# EAGLE design Power Board (EAGLE 7.6.0)
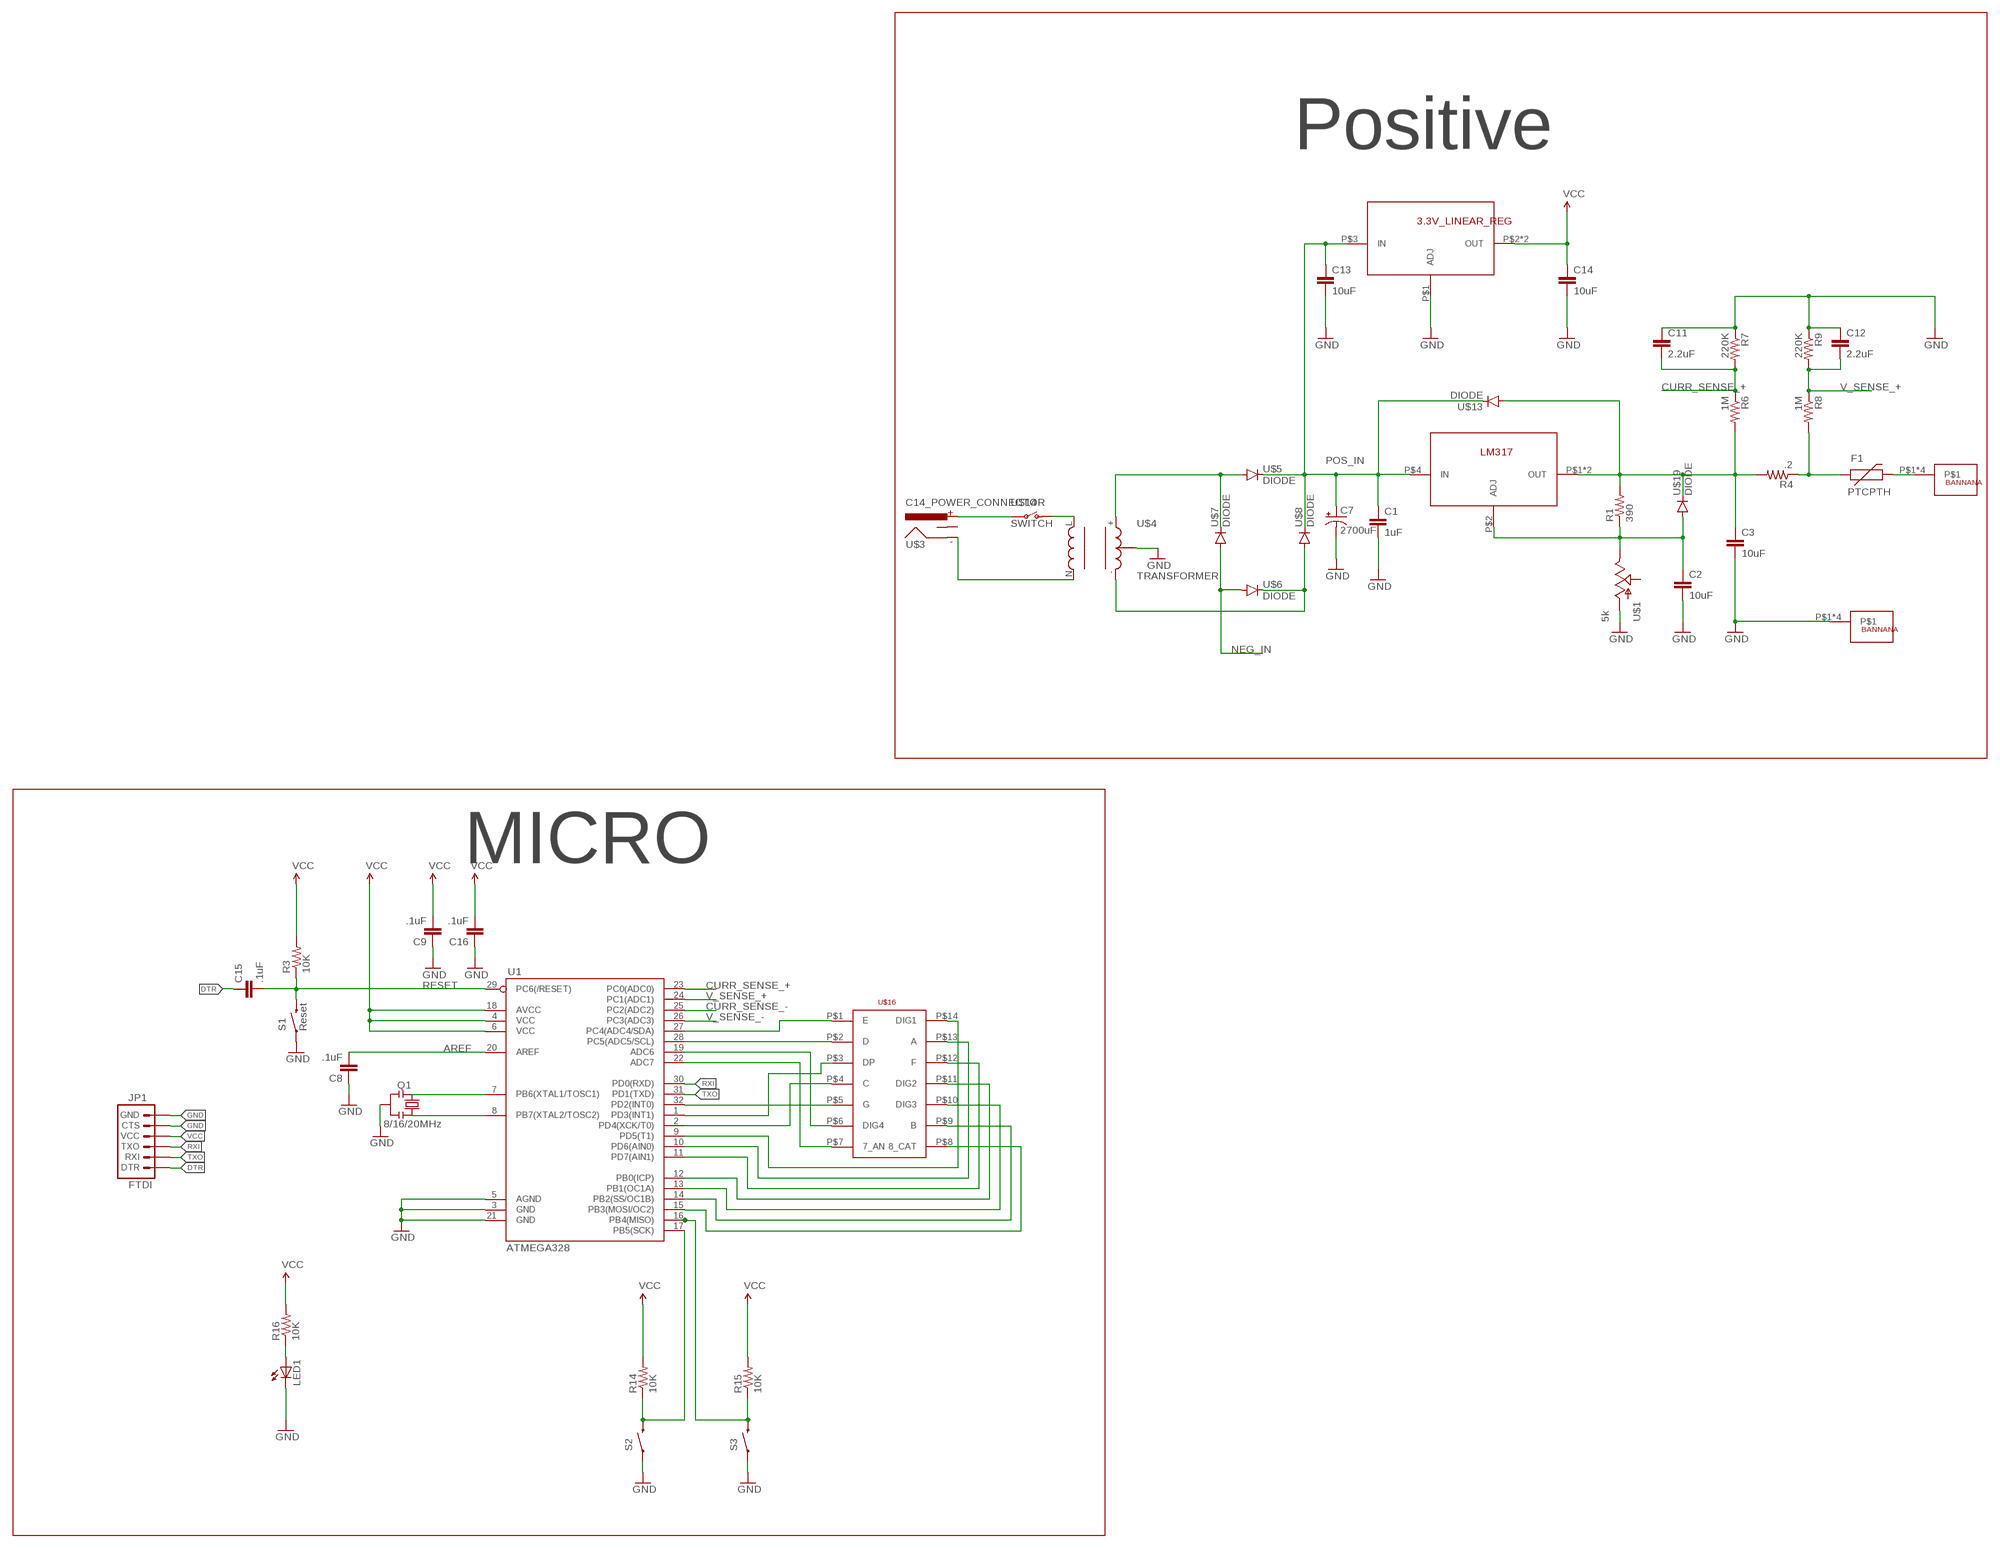
[diagram p0: schematic, sheet 1, part 1 of 2]
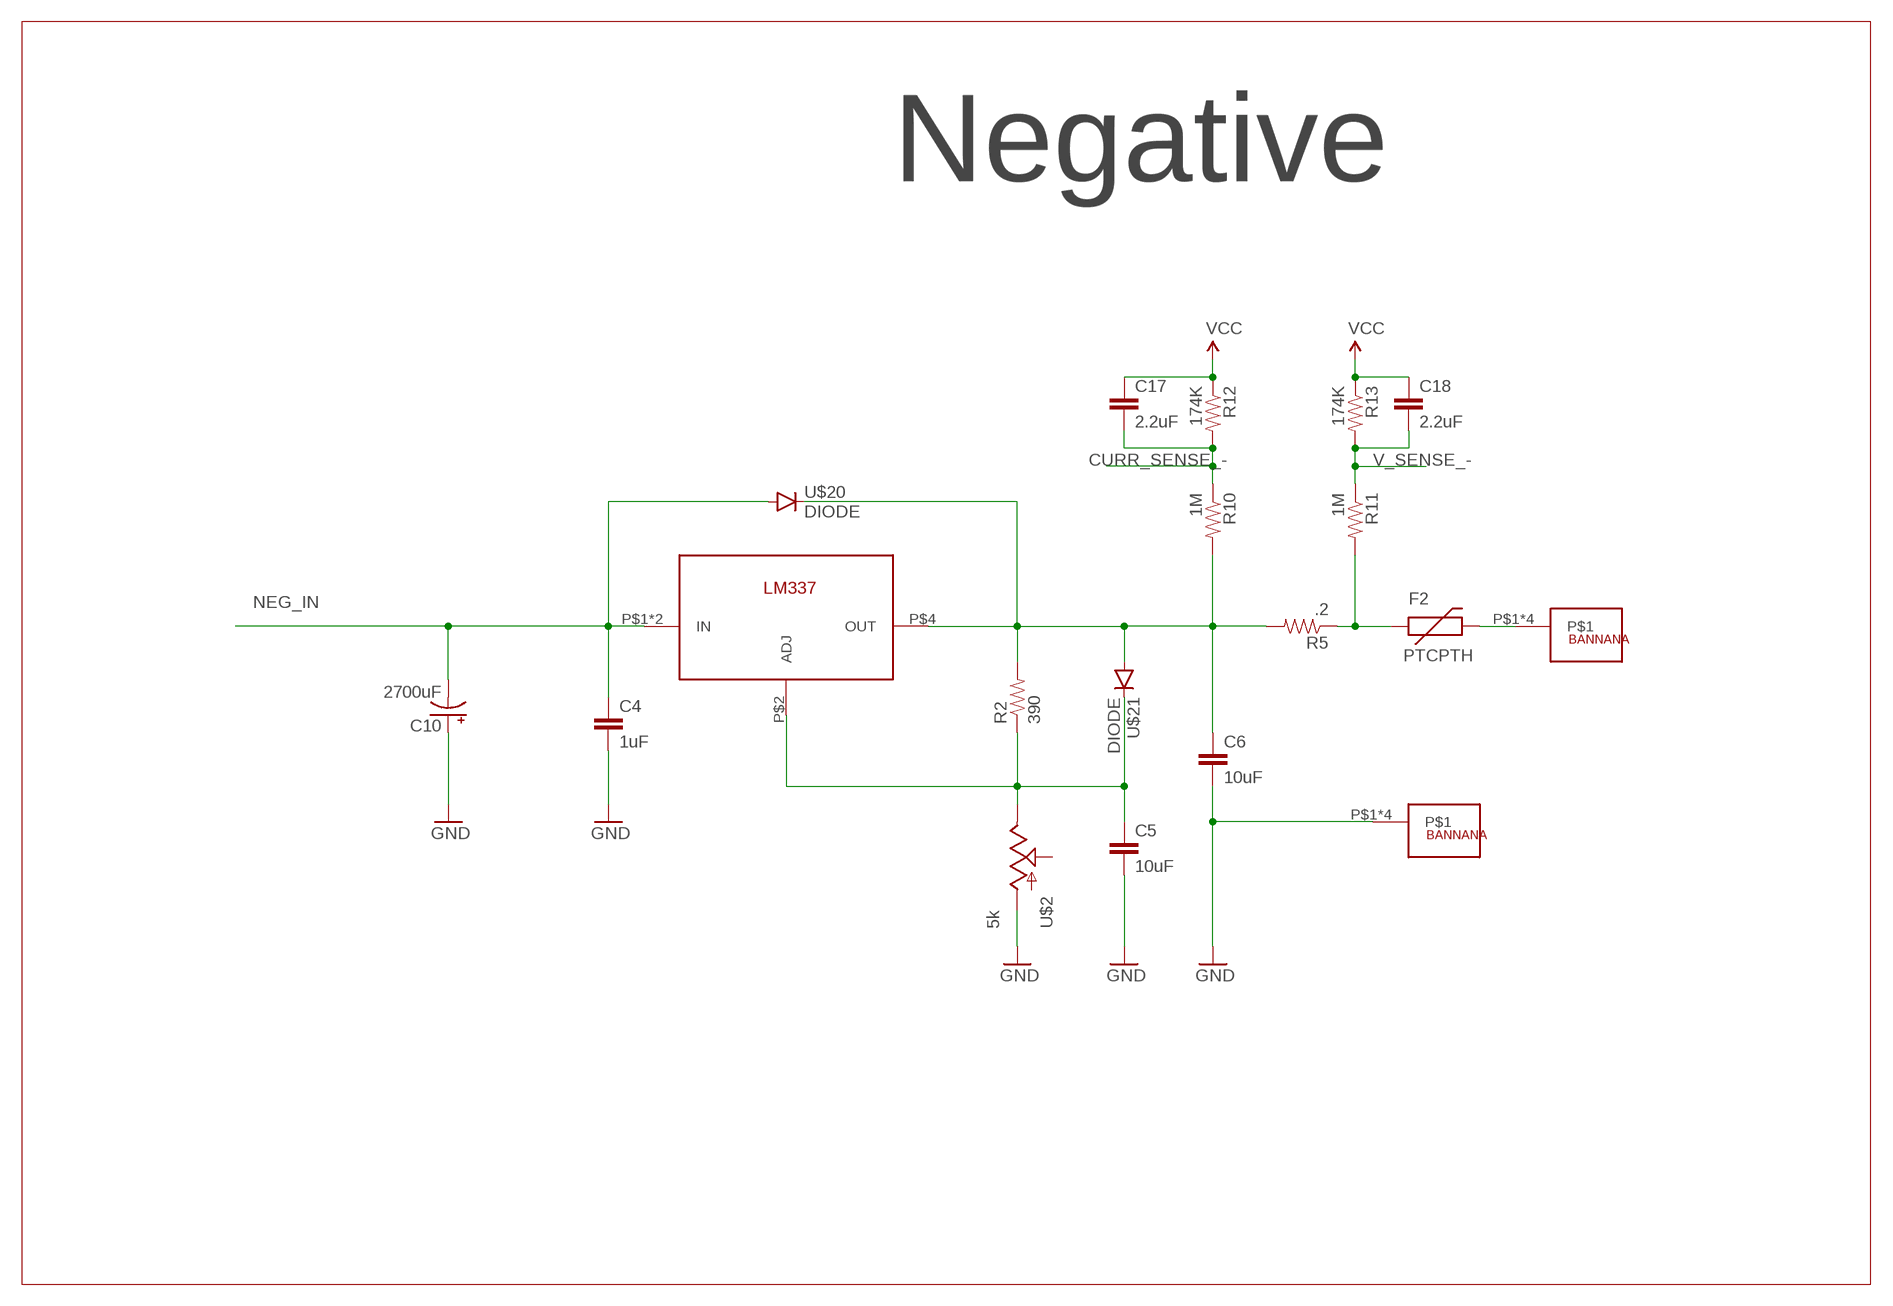
[diagram p1: schematic, sheet 1, part 2 of 2]

## Parts
3.3V_LINEAR_REG  3.3_LIN_REG  [3.3_LINEAR_REG]
C1  1uF  CAP1206  [1206]
C2  10uF  CAP1206  [1206]
C3  10uF  CAP1206  [1206]
C4  1uF  CAP1206  [1206]
C5  10uF  CAP1206  [1206]
C6  10uF  CAP1206  [1206]
C7  2700uF  CAP_POLPTH3  [CPOL-RADIAL-1000UF-63V]
C8  .1uF  CAP1206  [1206]
C9  .1uF  CAP1206  [1206]
C10  2700uF  CAP_POLPTH3  [CPOL-RADIAL-1000UF-63V]
C11  2.2uF  CAP1206  [1206]
C12  2.2uF  CAP1206  [1206]
C13  10uF  CAP1206  [1206]
C14  10uF  CAP1206  [1206]
C15  .1uF  CAP1206  [1206]
C16  .1uF  CAP1206  [1206]
C17  2.2uF  CAP1206  [1206]
C18  2.2uF  CAP1206  [1206]
F1  PTCPTH  [PTC]
F2  PTCPTH  [PTC]
JP1  FTDI  ARDUINO_SERIAL_PROGRAMPTH  [1X06]
LED1  LED1206  [LED-1206]
LM317  LM317  [KTT]
LM337  LM337  [KTT]
NEG-GND  BANNANA  [BANNANA]
NEG-OUT  BANNANA  [BANNANA]
POS-GND  BANNANA  [BANNANA]
POS-OUT  BANNANA  [BANNANA]
Q1  8/16/20MHz  RESONATOR1:1  [RESONATOR-SMD-1:1]
R1  390  RESISTOR1206  [1206]
R2  390  RESISTOR1206  [1206]
R3  10K  RESISTOR1206  [1206]
R4  .2  RESISTOR1206  [1206]
R5  .2  RESISTOR1206  [1206]
R6  1M  RESISTOR1206  [1206]
R7  220K  RESISTOR1206  [1206]
R8  1M  RESISTOR1206  [1206]
R9  220K  RESISTOR1206  [1206]
R10  1M  RESISTOR1206  [1206]
R11  1M  RESISTOR1206  [1206]
R12  174K  RESISTOR1206  [1206]
R13  174K  RESISTOR1206  [1206]
R14  10K  RESISTOR1206  [1206]
R15  10K  RESISTOR1206  [1206]
R16  10K  RESISTOR1206  [1206]
S1  Reset  SWITCH-MOMENTARY-2SMD-ALT01  [TACTILE-SWITCH-SMD-ALT01]
S2  Reset  SWITCH-MOMENTARY-2SMD-ALT01  [TACTILE-SWITCH-SMD-ALT01]
S3  Reset  SWITCH-MOMENTARY-2SMD-ALT01  [TACTILE-SWITCH-SMD-ALT01]
U1  ATMEGA328  ATMEGA168  [TQFP32-08]
U$1  5k  POT  [POT]
U$2  5k  POT  [POT]
U$3  C14_POWER_CONNECTOR  [PANEL_FOR_POWER]
U$4  TRANSFORMER  [TRANSFORMER]
U$5  DIODE  [DIODE]
U$6  DIODE  [DIODE]
U$7  DIODE  [DIODE]
U$8  DIODE  [DIODE]
U$13  DIODE  [DIODE]
U$14  SWITCH  [SWITCH]
U$16  4-DIGIT_7_SEG  [4-DIGIT_7-SEG]
U$19  DIODE  [DIODE]
U$20  DIODE  [DIODE]
U$21  DIODE  [DIODE]

## Nets
3.3V: C17.1 C18.1 R12.1 R13.1 R15.2 ; supply symbol labelled VCC
AREF: C8.2 U1.20(AREF)
CUR_SENS_+: C3.1 LM317.P$1(OUT) LM317.P$3(OUT) R1.2 R4.2 R6.2 U$13.A U$19.C
CURR_SENS_-: C6.1 LM337.P$4(OUT) R2.2 R5.2 R10.2 U$20.C U$21.A
CURR_SENSE_+: C11.2 R6.1 R7.2 U1.23(PC0(ADC0))
CURR_SENSE_-: C17.2 R10.1 R12.2 U1.25(PC2(ADC2))
DTR: C15.1 JP1.1(DTR)
GND: 3.3V_LINEAR_REG.P$1(ADJ) C1.2 C2.2 C3.2 C4.2 C5.2 C6.2 C7.2(-) C8.1 C9.1 C10.1(+) C11.1 C12.1 C13.2 C14.2 C16.1 JP1.5(CTS) JP1.6(GND) LED1.C NEG-GND.P$1 NEG-GND.P$2 NEG-GND.P$3 NEG-GND.P$4 POS-GND.P$1 POS-GND.P$2 POS-GND.P$3 POS-GND.P$4 Q1.2 R7.1 R9.1 S1.1 S1.2 S2.1 S2.2 S3.1 S3.2 U1.3(GND) U1.5(AGND) U1.21(GND) U$1.P$1(A) U$2.P$1(A) U$4.GND
N$1: U$3.P$3(LINE) U$14.P$3(P)
N$2: U$3.P$1(NEUTRAL) U$4.N
N$3: U$4.+ U$5.A U$7.C
N$4: U1.9(PD5(T1)) U$16.P$14(DIG1)
N$5: U$4.- U$6.C U$8.A
N$6: U1.27(PC4(ADC4/SDA)) U$16.P$1(E)
N$7: LED1.A R16.1
N$8: C2.1 LM317.P$2(ADJ) R1.1 U$1.P$3(E) U$19.A
N$9: U1.28(PC5(ADC5/SCL)) U$16.P$2(D)
N$10: Q1.3 U1.8(PB7(XTAL2/TOSC2))
N$11: U1.19(ADC6) U$16.P$6(DIG4)
N$12: C5.1 LM337.P$2(ADJ) R2.1 U$2.P$3(E) U$21.C
N$13: Q1.1 U1.7(PB6(XTAL1/TOSC1))
N$14: U1.22(ADC7) U$16.P$7(7_AN)
N$15: U1.32(PD2(INT0)) U$16.P$5(G)
N$18: U1.13(PB1(OC1A)) U$16.P$10(DIG3)
N$19: U1.10(PD6(AIN0)) U$16.P$13(A)
N$20: U1.11(PD7(AIN1)) U$16.P$12(F)
N$21: U1.12(PB0(ICP)) U$16.P$11(DIG2)
N$22: U1.14(PB2(SS/OC1B)) U$16.P$9(B)
N$23: U1.15(PB3(MOSI/OC2)) U$16.P$8(8_CAT)
N$24: U1.2(PD4(XCK/T0)) U$16.P$4(C)
N$25: F1.P$2 POS-OUT.P$1 POS-OUT.P$2 POS-OUT.P$3 POS-OUT.P$4
N$26: F2.P$2 NEG-OUT.P$1 NEG-OUT.P$2 NEG-OUT.P$3 NEG-OUT.P$4
N$27: U$4.L U$14.P$4(O)
N$28: U1.1(PD3(INT1)) U$16.P$3(DP)
N$29: R15.1 S3.3 S3.4 U1.16(PB4(MISO))
NEG_IN: C4.1 C10.2(-) LM337.P$1(IN) LM337.P$3(IN) U$6.A U$7.A U$20.A
POS_IN: 3.3V_LINEAR_REG.P$3(IN) C1.1 C7.1(+) C13.1 LM317.P$4(IN) U$5.C U$8.C U$13.C
RESET: C15.2 R3.1 S1.3 S1.4 U1.29(PC6(/RESET))
RESET1: R14.1 S2.3 S2.4 U1.17(PB5(SCK))
RXI: JP1.3(TXO) U1.30(PD0(RXD))
TXO: JP1.2(RXI) U1.31(PD1(TXD))
V_SENS_+: F1.P$1 R4.1 R8.2
V_SENS_-: F2.P$1 R5.1 R11.2
V_SENSE_+: C12.2 R8.1 R9.2 U1.24(PC1(ADC1))
V_SENSE_-: C18.2 R11.1 R13.2 U1.26(PC3(ADC3))
VCC: 3.3V_LINEAR_REG.P$2(OUT) 3.3V_LINEAR_REG.P$4(OUT) C9.2 C14.1 C16.2 JP1.4(VCC) R3.2 R14.2 R16.2 U1.4(VCC) U1.6(VCC) U1.18(AVCC)
Unconnected: U$1.P$2(S) U$2.P$2(S) U$3.P$2(GROUND)

## Notes on the sheet
- Positive
- Negative
- MICRO

## Library data of the parts
3.3V_LINEAR_REG = PowerSupply:3.3_LIN_REG
C1-C6 C8 C9 C11-C18 = SparkFun-Capacitors:CAP: Capacitor Standard 0603 ceramic capacitor, and 0.1" leaded capacitor.
C7 C10 = SparkFun-Capacitors:CAP_POL: Capacitor Polarized These are standard SMD and PTH capacitors. Normally 10uF, 47uF, and 100uF in electrolytic and tantalum varieties. Always verify the external diameter of the through hole cap, it varies with capacity, voltage, and manufacturer. The EIA devices should be standard.
F1 F2 = SparkFun-PowerIC:PTC: Resettable Fuse PTC Resettable Fuse. Spark Fun Electronics SKU : COM-08357
JP1 = SparkFun:ARDUINO_SERIAL_PROGRAM
LED1 = LilyPad-Wearables:LED: LEDs Standard schematic elements and footprints for 5mm, 3mm, 1206, and 0603 sized LEDs. 5mm - Spark Fun Electronics SKU : Comp-SBL
LM317 = PowerSupply:LM317
LM337 = PowerSupply:LM337
NEG-GND NEG-OUT POS-GND POS-OUT = PowerSupply:BANNANA
Q1 = Testing:RESONATOR: Resonator Small SMD resonator. This is the itty bitty 10/20MHz resonators with built in caps. CSTCE10M0G55 and CSTCE20M0V53. Footprint for SMD has been used in SFE production for years, and does work okay. 1:1 is an attempt to get larger fillets on the sides so it will be easier to inspect these solders in our AOI machine. The pads have been minimized to match the actual metal under the resonator. To see this relation, it includes an image import of the bottom side of the component. Imported to scale on layer 200.
R1-R16 = SparkFun-Resistors:RESISTOR: Resistor Basic schematic elements and footprints for 0603, 1206, and PTH resistors.
S1-S3 = Testing:SWITCH-MOMENTARY-2: Various NO switches- pushbuttons, reed, etc
U1 = SparkFun:ATMEGA168
U$1 U$2 = PowerSupply:POT
U$3 = PowerSupply:C14_POWER_CONNECTOR
U$4 = PowerSupply:TRANSFORMER
U$5-U$8 U$13 U$19-U$21 = PowerSupply:DIODE
U$14 = PowerSupply:SWITCH
U$16 = PowerSupply:4-DIGIT_7_SEG

## Net classes
1 vcc: width 0.254 mm

## Board
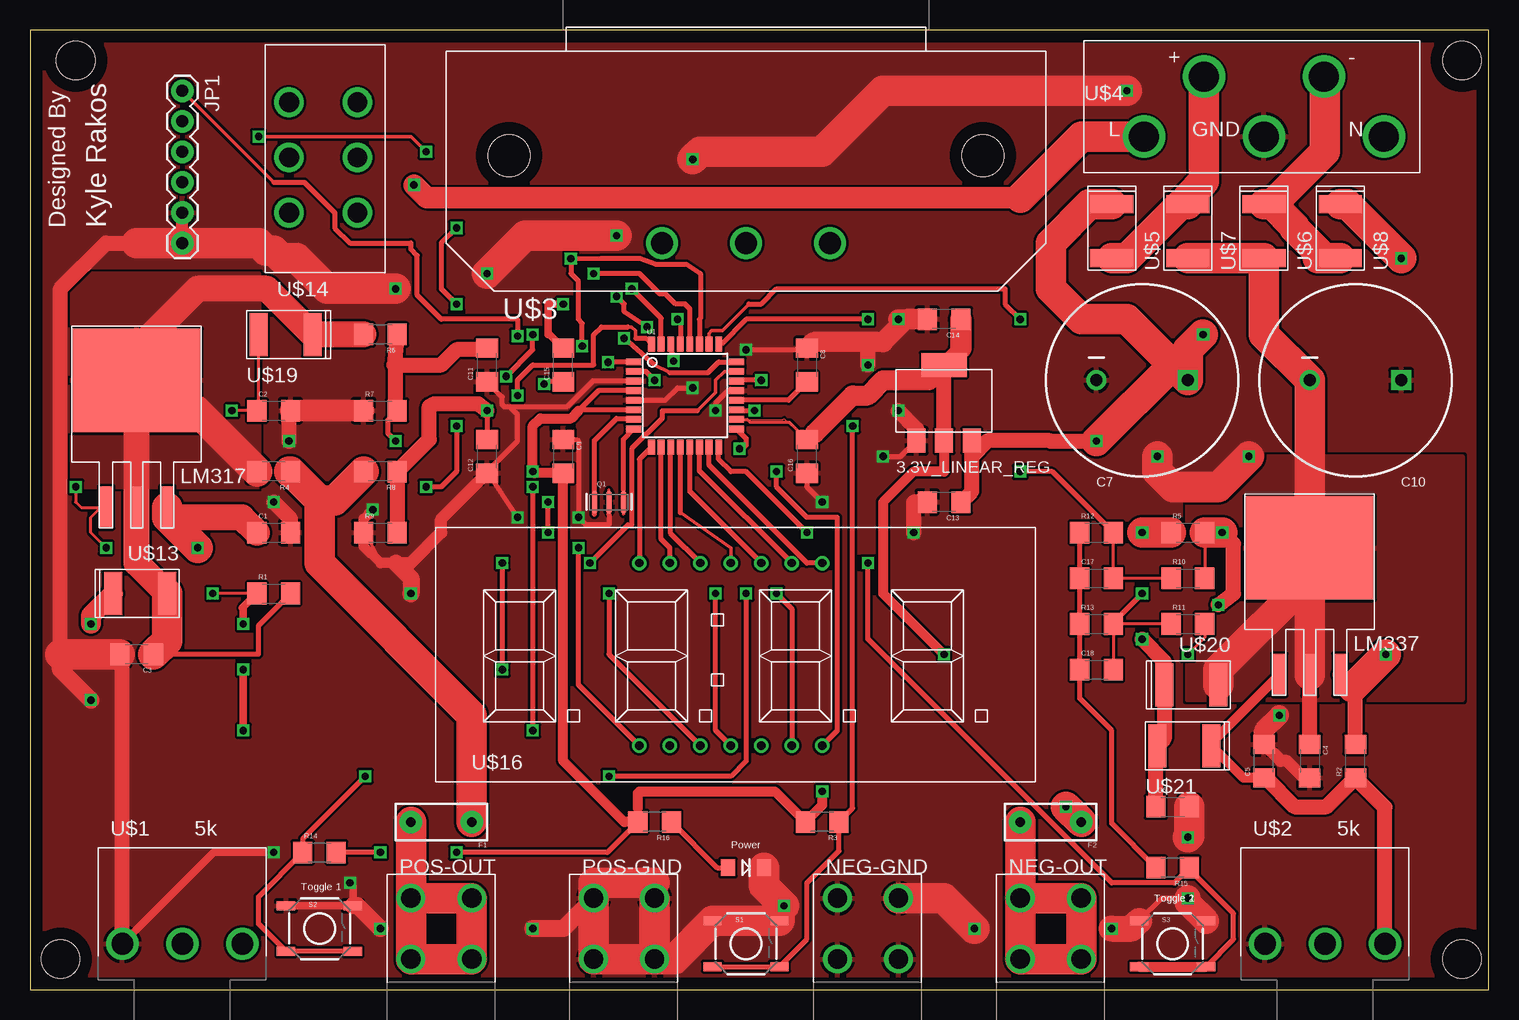
[diagram p2: board, top side]
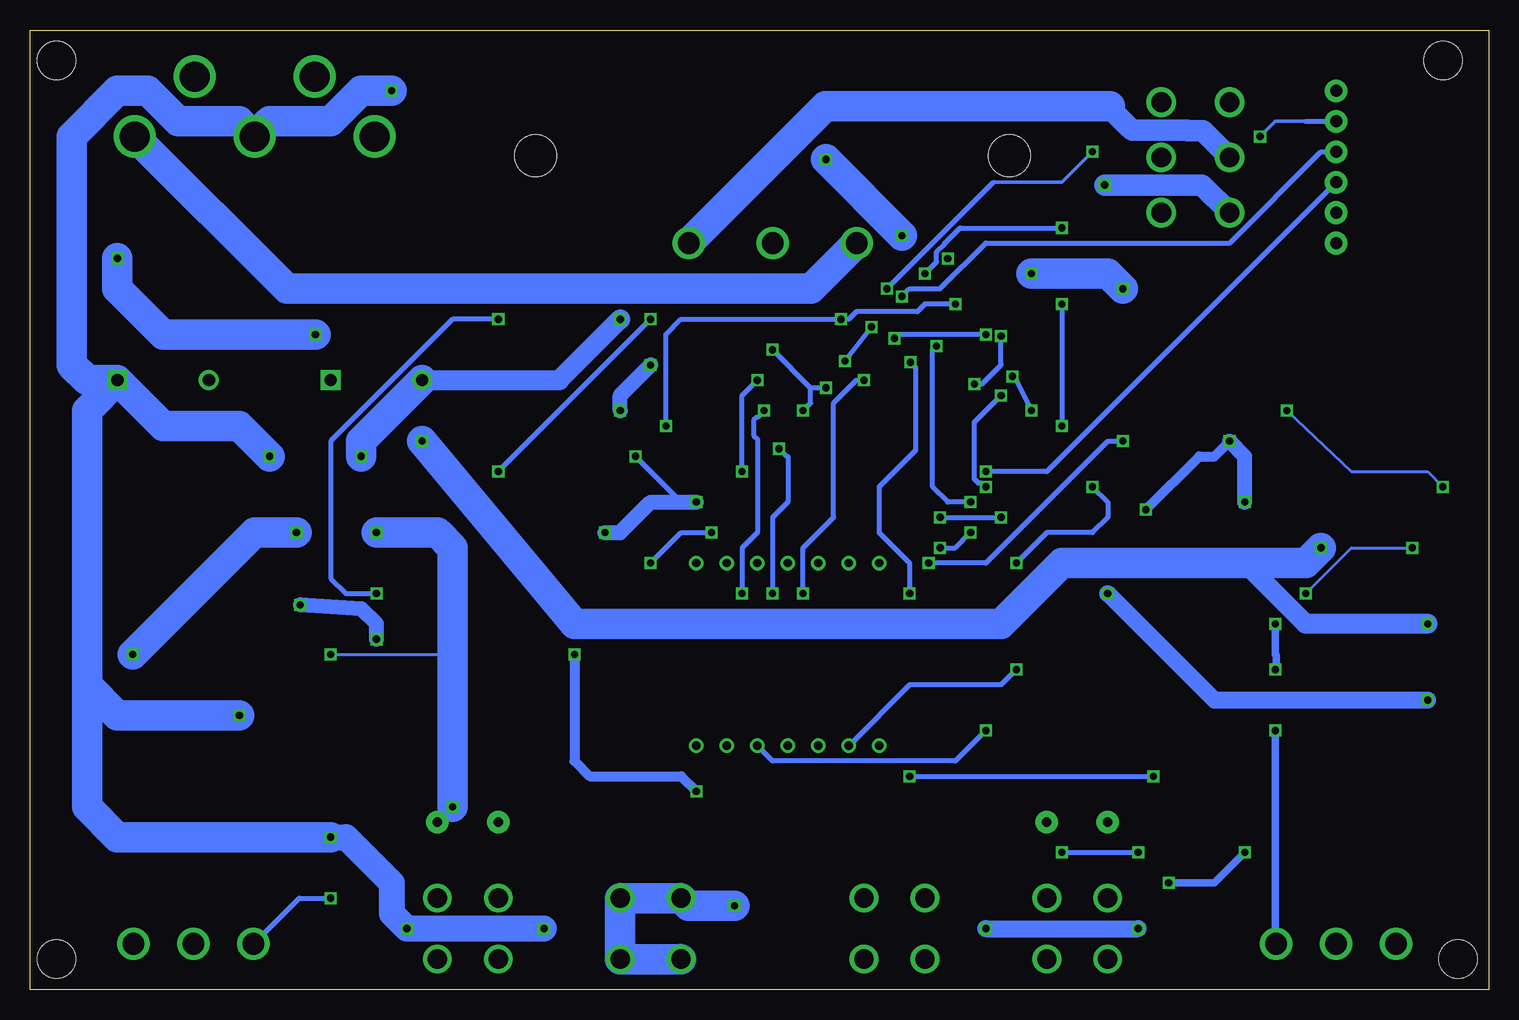
[diagram p3: board, bottom side, seen from below]

Size 121.59 x 80 mm. Coordinates in mm from the lower left corner, seen from the top.
Outline: 0,0 121.59,0 121.59,80 0,80 0,0
Copper layers (1*16): Top 0.035mm / dielectric 1.5mm / Bottom 0.035mm
Design rules "default": minimum track width 10mil, minimum drill 24mil, track to track 8mil, track to pad 8mil, pad to pad 8mil, via to via 8mil, smd to smd 8mil, copper to edge 40mil, drill to drill 8mil, minimum pad ring 10mil, minimum via ring 8mil, stop-mask expansion 4mil, vias tented up to drill 0mil, thermal gap 10mil
Holes 3.2 mm at 119.38,77.47 119.38,2.54 2.54,2.54 3.81,77.47

### Footprints (pad centres in the part's own frame; a part is rotated, then mirrored left to right if it is on the bottom)
3.3_LINEAR_REG = smd 1.5 x 2: P$1 -2.3,-6.3; P$2 0,-6.3; P$3 2.3,-6.3 | smd 3.8 x 2: P$4 0,0
1206 = smd 1.6 x 1.8: 1 -1.4,0; 2 1.4,0
CPOL-RADIAL-1000UF-63V = drill 1.016 pad 1.651 square: 1 3.81,0 | drill 1.016 pad 1.676: 2 -3.81,0
PTC = drill 0.8 pad 1.88: P$1 -2.54,0; P$2 2.54,0
1X06 = drill 1.016 pad 1.88: 1 0,0; 2 2.54,0; 3 5.08,0; 4 7.62,0; 5 10.16,0; 6 12.7,0
LED-1206 = smd 1.2 x 1.4: A -1.5,0; C 1.5,0
KTT = smd 10.7 x 8.6: P$1 0,0 | smd 1.1 x 3.5: P$2 -2.54,-10.6; P$3 0,-10.6; P$4 2.54,-10.6
BANNANA = drill 1.6: P$1 0,0; P$2 5.08,0; P$3 0,-5.08; P$4 5.08,-5.08
RESONATOR-SMD-1:1 = smd 0.45 x 1.905: 1 -1.2,0; 2 0,0; 3 1.2,0
TACTILE-SWITCH-SMD-ALT01 = smd 1.524 x 0.762: 1 -2.794,1.905; 2 2.794,1.905; 3 -2.794,-1.905; 4 2.794,-1.905
TQFP32-08 = smd 1.27 x 0.559: 1 -4.293,2.8; 2 -4.293,2; 3 -4.293,1.2; 4 -4.293,0.4; 5 -4.293,-0.4; 6 -4.293,-1.2; 7 -4.293,-2; 8 -4.293,-2.8; 17 4.293,-2.8; 18 4.293,-2; 19 4.293,-1.2; 20 4.293,-0.4; 21 4.293,0.4; 22 4.293,1.2; 23 4.293,2; 24 4.293,2.8 | smd 0.559 x 1.27: 9 -2.8,-4.293; 10 -2,-4.293; 11 -1.2,-4.293; 12 -0.4,-4.293; 13 0.4,-4.293; 14 1.2,-4.293; 15 2,-4.293; 16 2.8,-4.293; 25 2.8,4.293; 26 2,4.293; 27 1.2,4.293; 28 0.4,4.293; 29 -0.4,4.293; 30 -1.2,4.293; 31 -2,4.293; 32 -2.8,4.293
POT = drill 1.8: P$1 -5,0; P$2 0,0; P$3 5,0
PANEL_FOR_POWER = drill 1.8: P$1 -7,0; P$2 0,0; P$3 7,0 | hole 3.5: -19.75,7.3; 19.75,7.3
TRANSFORMER = drill 2.5: + -5,5; - 5,5; GND 0,0; L -10,0; N 10,0
DIODE = smd 1.5 x 3.6: A 0,0; C 4.5,0
SWITCH = drill 1.655: P$1 5.7,0; P$2 5.7,4.6; P$3 0,4.6; P$4 0,0; P$5 5.7,9.2; P$6 0,9.2
4-DIGIT_7-SEG = drill 0.7: P$1 0,0; P$2 2.54,0; P$3 5.08,0; P$4 7.62,0; P$5 10.16,0; P$6 12.7,0; P$7 15.24,0; P$8 15.24,15.24; P$9 12.7,15.24; P$10 10.16,15.24; P$11 7.62,15.24; P$12 5.08,15.24; P$13 2.54,15.24; P$14 0,15.24

### Placement (x,y rotation side)
3.3V_LINEAR_REG  76.2,52.07 0 top
C1  20.32,38.1 0 top
C2  20.32,48.26 0 top
C3  8.89,27.94 180 top
C4  106.68,19.05 270 top
C5  102.87,19.05 90 top
C6  95.25,15.24 0 top
C7  92.71,50.8 0 top
C8  64.77,52.07 270 top
C9  44.45,44.45 270 top
C10  110.49,50.8 0 top
C11  38.1,52.07 90 top
C12  38.1,44.45 90 top
C13  76.2,40.64 180 top
C14  76.2,55.88 180 top
C15  44.45,52.07 90 top
C16  64.77,44.45 90 top
C17  88.9,34.29 0 top
C18  88.9,26.67 0 top
F1  34.29,13.97 180 top
F2  85.09,13.97 180 top
JP1  12.7,74.93 270 top
LED1  59.69,10.16 0 top
LM317  8.89,50.8 0 top
LM337  106.68,36.83 0 top
NEG-GND  67.31,7.62 0 top
NEG-OUT  82.55,7.62 0 top
POS-GND  46.99,7.62 0 top
POS-OUT  31.75,7.62 0 top
Q1  48.26,40.64 0 top
R1  20.32,33.02 0 top
R2  110.49,19.05 90 top
R3  66.04,13.97 180 top
R4  20.32,43.18 180 top
R5  96.52,38.1 0 top
R6  29.21,54.61 180 top
R7  29.21,48.26 0 top
R8  29.21,43.18 180 top
R9  29.21,38.1 0 top
R10  96.52,34.29 0 top
R11  96.52,30.48 0 top
R12  88.9,38.1 0 top
R13  88.9,30.48 0 top
R14  24.13,11.43 0 top
R15  95.25,10.16 180 top
R16  52.07,13.97 180 top
S1  59.69,3.81 0 top
S2  24.13,5.08 0 top
S3  95.25,3.81 0 top
U1  54.61,49.53 0 top
U$1  12.7,3.81 0 top
U$2  107.95,3.81 0 top
U$3  59.69,62.23 0 top
U$4  102.87,71.12 0 top
U$5  90.17,60.96 90 top
U$6  102.87,60.96 90 top
U$7  96.52,60.96 90 top
U$8  109.22,60.96 90 top
U$13  11.43,33.02 180 top
U$14  21.59,64.77 0 top
U$16  50.8,20.32 0 top
U$19  19.05,54.61 0 top
U$20  99.06,25.4 180 top
U$21  93.98,20.32 0 top

### Tracks (layer width: path | path; a pad name or v marks a point on that pad's centre or on a via)
3.3V
  Top 0.406: R15.2 90.17,13.84 90.17,21.59 87.5,24.26 C18.1 R13.1 C17.1 R12.1
AREF
  Top 0.406: C8.2 63.23,49.13 U1.20
CUR_SENS_+
  Top 0.406: C3.1 19.05,27.94 19.05,30.35 R1.2
  Top 2.184: U$13.A 8.89,35.56 LM317.P$3 8.89,48.26 | LM317.P$1 8.89,53.34 13.97,58.42 19.74,58.42 U$19.C R6.2
  Top 2.54: LM317.P$1 8.89,48.26 13.84,48.26 R4.2 | C3.1 11.43,29.08 U$13.A
  pour Top: 1.27,44.45 1.27,59.69 19.05,59.69 19.05,41.91 1.27,41.91
CURR_SENS_-  (via drill 0.6)
  Top 0.254: R5.2 R10.2
  Top 1.27: R2.2 110.49,24.96 110.27,25.18 LM337.P$4 | v92.71,29.21 94.56,27.36 U$20.C 94.56,20.9 U$21.A 93.85,20.19 C6.1 | v99.06,32.07 100.33,33.02 100.33,37.15 v99.38,38.1
  Top 2.54: R5.2 v99.38,38.1 | v113.03,27.94 110.27,25.18
  Bottom 1.27: v92.71,29.21 92.71,30.48 93.98,31.75 v99.06,32.07
  Bottom 2.54: v99.38,38.1 102.87,38.1 v113.03,27.94
CURR_SENSE_+  (via drill 0.6)
  Top 0.305: U1.23 57.88,51.53 57.15,50.8 57.15,49.78 55.63,48.26
  Top 0.406: v30.48,45.72 29.84,46.35 29.84,47.49 R7.2 | 55.63,48.26 52.7,48.26 52.7,47.62 50.16,45.09 50.16,38.73 49.85,38.73 v46.67,35.56
  Top 1.27: C11.2 37.97,53.34 35.56,53.34 34.29,52.07 30.48,52.07 | R6.1 30.35,52.07 30.48,52.07 | R7.2 30.48,48.39 30.48,52.07
  Bottom 0.406: v30.48,45.72 31.75,45.72 41.91,35.56 v46.67,35.56
CURR_SENSE_-  (via drill 0.6)
  Top 0.254: R10.1 C17.2 R12.2
  Top 0.406: R12.2 85.22,43.18 v82.55,43.18 | v69.85,55.88 59.69,55.88 57.63,53.82 U1.25
  Bottom 0.406: v82.55,43.18 v69.85,55.88
DTR  (via drill 0.6)
  Top 0.305: 20.32,67.31 JP1.1
  Top 0.406: 20.32,67.31 22.86,67.31 25.4,64.77 25.4,63.5 26.67,62.23 31.75,62.23 31.75,61.72 32.28,61.19 32.28,57.89 34.29,55.88 40.64,55.88 v40.64,54.48 | C15.1 43.05,50.67 v42.86,50.48
  Bottom 0.406: v42.86,50.48 42.23,50.48 40.64,52.07 v40.64,54.48
GND  (via drill 0.6)
  Top 0.254: U1.3 46.99,50.73 46.99,50.8 45.09,48.9 | 27.94,36.83 27.94,38.1 29.21,35.56
  Top 0.406: C9.1 45.59,45.85 45.72,45.72 v45.72,39.37 46.35,38.73 48.26,38.73 48.26,39.62 | v71.12,44.45 72.58,44.45 3.3V_LINEAR_REG.P$1 | C16.1 64.77,41.91 v66.04,40.64 | v96.52,7.62 94.36,7.62 S3.1 | 50.87,50.73 U1.3 46.92,50.73 45.09,48.9 44.77,48.58 40.01,48.58 | U1.5 52.94,49.13 53.98,50.16 v55.24,50.16 | v57.15,48.26 57.15,48.9 58.19,49.93 U1.21 | v59.69,53.34 64.64,53.34 C8.1 | v40.64,39.37 38.1,43.18 | 40.01,48.58 40.64,47.94 40.64,45.72 39.37,44.45 38.1,43.18 | 40.01,48.58 39.56,48.58 39.37,48.77 39.37,49.4 C11.1 | C12.1 38.1,43.18
  Top 0.61: S2.1 S2.2 26.92,8.64 v26.67,8.89 | U$1.P$1 15.32,11.43 v20.32,11.43
  Top 0.813: v28.57,40.01 27.81,39.24 R9.1 27.81,36.96 27.94,36.83 29.21,35.56 30.48,35.56 | C12.1 37.97,43.05
  Top 1.016: C4.2 106.17,17.65 104.78,19.05 104.27,19.05 C5.2 | JP1.6 JP1.5 | 30.48,35.56 31.75,35.56 34.29,38.1 34.29,39.24 C12.1
  Top 1.27: 3.3V_LINEAR_REG.P$1 73.9,46.75 v72.39,48.26 | v69.85,52.07 69.85,53.98 | C13.2 73.66,40.64 v73.66,38.1 | 2.54,27.94 2.54,58.42 6.35,62.23 8.89,62.23 JP1.6 | U$1.P$1 7.7,27.73 C3.2 | C1.2 21.72,39.24 v20.32,40.64 | v21.59,45.72 21.59,48.13 C2.2
  Top 1.422: POS-GND.P$1 44.45,5.08 v41.91,5.08 | v29.21,5.08 27.3,6.99 S2.2 | 30.48,35.56 31.75,34.29 v31.75,33.02 | v5.08,24.13 2.54,26.67 2.54,27.94
  Top 1.676: C8.1 65.28,53.98 69.85,53.98 71.12,53.98 73.03,55.88 C14.2 v72.39,55.88 | C5.2 102.87,21.59 v104.14,22.86
  Top 1.778: R7.1 C2.2
  Top 2.184: v90.17,5.08 91.82,5.08 S3.1 | v96.52,7.62 96.52,7.24 S3.2
  Top 2.54: v93.98,44.45 93.98,43.18 95.25,41.91 99.06,41.91 v101.6,44.45 | POS-GND.P$2 POS-GND.P$4 | POS-GND.P$4 53.72,2.54 S1.1 S1.2 62.48,6.6 v62.87,6.99 61.19,8.66 LED1.C | NEG-GND.P$2 76.2,7.62 v78.74,5.08 | C3.2 2.54,27.94 | 8.89,62.23 19.05,62.23 19.68,61.59 20.32,61.59 20.95,60.96 22.23,60.96 24.77,58.42 v30.48,58.42 | v38.1,59.69 41.27,62.87 v48.9,62.87 | v55.24,69.22 55.88,69.85 66.04,69.85 71.12,74.93 v91.44,74.93 | C6.2 96.65,12.83 v96.52,12.7 | 52.07,8.89 46.99,8.89 POS-GND.P$3 POS-GND.P$4
  Bottom 0.406: v66.04,40.64 67.31,40.64 v71.12,44.45 | U$2.P$1 99.14,7.62 v96.52,7.62 | v55.24,50.16 56.52,50.16 | v57.15,48.26 56.52,48.9 56.52,50.16 | 56.52,50.16 v59.69,53.34 | v45.72,39.37 v40.64,39.37
  Bottom 0.61: v20.32,11.43 22.86,8.89 v26.67,8.89
  Bottom 0.813: v28.57,40.01 24.13,44.45 22.86,44.45 v21.59,45.72
  Bottom 1.27: v72.39,48.26 72.39,49.53 v69.85,52.07 | v73.66,38.1 72.39,38.1 69.85,40.64 v66.04,40.64 | v20.32,40.64 20.32,44.45 v21.59,45.72
  Bottom 1.422: v41.91,5.08 v29.21,5.08 | v31.75,33.02 22.86,24.13 v5.08,24.13
  Bottom 1.676: C7.2 77.47,50.8 v72.39,55.88
  Bottom 2.184: v78.74,5.08 v90.17,5.08 91.44,6.35 91.44,8.89 95.25,12.7 v96.52,12.7
  Bottom 2.54: C10.1 116.84,50.8 118.11,52.07 118.11,71.12 114.3,74.93 111.76,74.93 109.22,72.39 104.14,72.39 U$4.GND 101.6,72.39 96.52,72.39 93.98,74.93 v91.44,74.93 | C7.2 93.98,45.72 v93.98,44.45 | v101.6,44.45 104.14,46.99 110.49,46.99 C10.1 | v104.14,22.86 114.3,22.86 116.84,25.4 | 116.84,25.4 116.84,48.26 C10.1 | v62.87,6.99 66.67,6.99 NEG-GND.P$1 NEG-GND.P$2 NEG-GND.P$4 NEG-GND.P$3 | v30.48,58.42 31.75,59.69 v38.1,59.69 | v48.9,62.87 v55.24,69.22 | v96.52,12.7 114.3,12.7 116.84,15.24 116.84,25.4
  pour Top (rank 2): 0,80.01 0,0 121.92,0 121.92,80.01
N$1
  Bottom 1.778: 31.58,73.66 31.58,73.49 29.95,71.86 29.92,71.86 29.69,71.63 25.12,71.63 25.09,71.6 23.82,71.6 U$14.P$3
  Bottom 2.54: U$3.P$3 55.26,73.66 31.58,73.66
N$2
  Bottom 2.54: U$3.P$1 56.5,58.42 100.17,58.42 U$4.N
N$3
  Top 2.54: U$4.+ 97.87,67.39 96.52,66.04 U$7.C 95.94,65.46 91.44,60.96 U$5.A
N$4
  Top 0.406: U1.9 50.8,44.23 U$16.P$14
N$5
  Top 2.54: U$8.A 107.37,60.96 107.37,61.54 105.41,63.5 105.41,63.61 103.56,65.46 | U$6.C 103.56,65.46 | 103.56,65.46 107.95,69.85 107.95,76.04 U$4.-
N$6  (via drill 0.6)
  Top 0.406: U$16.P$1 45.72,25.4 v45.72,36.83 | U1.27 55.81,55.88 55.88,55.95 55.88,59.69 54.71,60.48 52.17,60.48 50.8,60.96 47.62,60.96 v45.09,60.94 45.09,59.69 45.72,59.05 45.72,55.88 46.04,55.56 v46.04,53.66 | v43.18,38.1 v43.18,40.64
  Bottom 0.406: v46.04,53.66 46.35,53.34 46.35,41.91 45.09,40.64 v43.18,40.64 | v45.72,36.83 44.45,36.83 v43.18,38.1
N$7
  Top 0.406: R16.1 57.28,10.16 LED1.A
N$8  (via drill 0.6)
  Top 0.254: U$19.A 19.05,48.39 C2.1 v16.83,48.26 | v3.81,41.91 3.81,40.64 4.25,40.2 LM317.P$2 5.91,40.2 5.08,39.37 5.08,38.1 v6.35,36.83 | R1.1 v15.24,33.02
  Top 0.61: R1.1 17.7,31.8 17.78,31.72 v17.78,30.48 | v17.78,26.67 v17.78,21.59
  Bottom 0.254: v16.83,48.26 11.43,43.18 5.08,43.18 v3.81,41.91 | v15.24,33.02 11.43,36.83 v6.35,36.83
  Bottom 0.61: v17.78,30.48 17.78,27.94 17.7,27.86 17.7,26.75 v17.78,26.67 | v17.78,21.59 17.78,3.89 U$1.P$3
N$9  (via drill 0.6)
  Top 0.406: U1.28 55.01,56.75 54.61,57.15 53.82,57.15 52.98,57.99 52.5,57.99 50.8,59.69 v46.99,59.69 | v35.56,63.5 34.29,62.23 34.29,58.42 v35.56,57.15 | v35.56,46.99 35.56,43.18 34.29,41.91 v33.02,41.91 | v39.37,35.56 v39.37,26.67
  Bottom 0.406: v46.99,59.69 46.02,60.66 46.02,61.52 45.34,62.2 45.34,62.23 44.07,63.5 v35.56,63.5 | v35.56,57.15 v35.56,46.99 | v33.02,41.91 31.75,40.64 31.75,39.37 33.02,38.1 36.83,38.1 v39.37,35.56 | v39.37,26.67 40.64,25.4 48.26,25.4 U$16.P$2
N$10
  Top 0.406: 49.46,41.66 49.46,45.87 U1.8
N$11  (via drill 0.6)
  Top 0.406: U1.19 58.97,48.26 v60.4,48.26 | v62.23,33.02 63.5,31.75 U$16.P$6
  Bottom 0.406: v60.4,48.26 60.96,47.7 61.04,47.7 61.27,47.47 61.27,46.2 60.96,45.9 60.96,38.1 62.23,36.83 v62.23,33.02
N$12
  Top 0.813: C5.1 101.15,17.65 U$21.C 98.48,20.57 LM337.P$2
  Top 1.27: U$2.P$3 112.95,15.19 R2.1 108.08,15.24 105.41,15.24 103,17.65 C5.1
N$13
  Top 0.406: 47.06,39.62 47.06,45.79 48.9,47.62 50.22,47.62 U1.7
N$14  (via drill 0.6)
  Top 0.406: U$16.P$7 67.31,21.59 67.31,39.37 64.77,39.37 62.23,41.91 v62.23,43.18 | v60.96,50.8 58.97,50.8 U1.22
  Bottom 0.406: v62.23,43.18 62.23,49.53 v60.96,50.8
N$15  (via drill 0.6)
  Top 0.305: 49.85,55.24 50.16,55.24 50.48,54.93 50.48,54.29
  Top 0.406: v41.91,41.91 v41.91,21.59 | v40.64,49.53 40.64,50.8 41.91,52.07 46.99,52.07 46.99,54.61 47.62,55.24 49.85,55.24 | 50.48,54.29 51.34,54.29 U1.32
  Bottom 0.406: v41.91,21.59 44.45,19.05 59.69,19.05 U$16.P$5 | v41.91,41.91 42.23,42.23 42.55,42.23 42.86,42.55 42.86,47.31 v40.64,49.53
N$18
  Top 0.406: U$16.P$10 55.01,41.51 U1.13
N$19
  Top 0.406: U$16.P$13 53.34,36.83 52.61,37.56 U1.10
N$20
  Top 0.406: U$16.P$12 53.41,38.03 U1.11
N$21
  Top 0.305: U$16.P$11 58.42,36.83 54.21,39.77
  Top 0.406: 54.21,39.77 U1.12
N$22
  Top 0.406: U$16.P$9 55.81,43.25 U1.14
N$23
  Top 0.406: U$16.P$8 64.77,35.56 56.61,43.72 U1.15
N$24  (via drill 0.6)
  Top 0.406: v52.07,50.8 51.34,51.53 U1.2 | U$16.P$4 57.15,21.59 v57.15,33.02
  Bottom 0.406: v52.07,50.8 52.7,50.8 54.61,48.9 54.61,39.37 57.15,36.83 v57.15,33.02
N$25
  Top 2.54: POS-OUT.P$1 POS-OUT.P$3 POS-OUT.P$4 POS-OUT.P$2 POS-OUT.P$1 | POS-OUT.P$1 F1.P$2
N$26
  Top 2.54: NEG-OUT.P$1 NEG-OUT.P$2 NEG-OUT.P$4 NEG-OUT.P$3 NEG-OUT.P$1 | NEG-OUT.P$1 F2.P$2
N$27  (via drill 0.6)
  Top 1.778: v32,67.08 33.05,66.04 82.55,66.04
  Top 2.54: U$4.L 87.63,71.12 82.55,66.04
  Bottom 1.778: U$14.P$4 23.9,67.08 v32,67.08
N$28  (via drill 0.6)
  Top 0.406: U1.1 50.29,52.3 v48.18,52.3 | v48.26,33.02 48.26,27.94 U$16.P$3
  Bottom 0.406: v48.18,52.3 48.18,52.27 47.78,51.87 47.78,44.93 50.8,41.91 50.8,38.1 48.26,35.56 v48.26,33.02
N$29  (via drill 0.6)
  Top 0.406: S3.4 100.33,4.19 100.33,6.35 96.65,10.03 R15.1 95.38,8.89 90.17,8.89 69.85,29.21 v69.85,35.56 | v64.77,38.1 59.69,43.18 58.42,43.18 57.41,44.19 U1.16
  Top 0.813: S3.3 S3.4
  Bottom 0.406: v69.85,35.56 67.31,38.1 v64.77,38.1
NEG_IN
  Top 1.27: C4.1 LM337.P$3
  Top 2.54: U$7.A U$6.A 102.87,54.61 C10.2 LM337.P$1 106.68,34.29 | LM337.P$3 106.68,34.29 | U$20.A 99.06,26.67 106.68,34.29
  pour Top: 119.38,24.13 96.52,24.13 96.52,44.45 119.38,44.45
POS_IN  (via drill 0.6)
  Top 1.27: v88.9,45.72 85.09,45.72 85.04,45.77 79.82,45.77 78.5,44.45 | C13.1 78.5,41.54 78.5,44.45 | 78.5,44.45 3.3V_LINEAR_REG.P$3
  Top 1.676: U$13.C 5.08,31.17 v5.08,30.48
  Top 2.184: C1.1 17.65,39.37 11.43,39.37
  Top 2.54: U$5.C 88.32,65.46 85.09,62.23 85.09,58.42 87.63,55.88 91.44,55.88 95.25,52.07 | 95.25,52.07 C7.1 96.52,53.34 v97.79,54.61 | LM317.P$4 11.43,39.37 v13.97,36.83 | v88.9,45.72 95.25,52.07 | U$8.C 109.8,65.46 v114.3,60.96
  Bottom 1.676: v5.08,30.48 15.24,30.48 20.32,35.56
  Bottom 2.54: v13.97,36.83 15.24,35.56 20.32,35.56 35.56,35.56 40.64,30.48 76.2,30.48 v88.9,45.72 | v114.3,60.96 114.3,58.42 110.49,54.61 v97.79,54.61
RESET  (via drill 0.6)
  Top 0.406: S1.3 S1.4 64.77,4.19 64.77,8.89 67.44,11.56 R3.1 68.58,15.11 v68.58,46.99 | v53.98,55.88 54.21,55.65 U1.29
  Top 0.61: v44.45,57.15 43.18,57.15 43.18,54.61 43.31,54.61 C15.2
  Bottom 0.406: v68.58,46.99 68.58,54.61 67.31,55.88 v53.98,55.88 53.34,55.88 52.7,56.52 47.62,56.52 46.99,57.15 v44.45,57.15
RESET1  (via drill 0.6)
  Top 0.406: S2.4 S2.3 19.05,5.46 19.05,7.75 R14.1 22.73,12.57 v27.94,17.78 | U1.17 59.69,45.94 59.69,45.39 59.38,45.09 v59.16,45.09 | v59.69,33.02 59.69,19.05 58.42,17.78 v48.26,17.78
  Bottom 0.406: v59.16,45.09 58.52,44.45 58.42,44.45 58.42,40.64 59.69,39.37 v59.69,33.02 | v48.26,17.78 v27.94,17.78
RXI  (via drill 0.6)
  Top 0.406: U1.30 53.34,53.75 v53.66,52.39 | v51.44,55.24 49.53,56.52 49.53,57.15 v48.9,57.78
  Bottom 0.406: v53.66,52.39 v51.44,55.24 | v48.9,57.78 48.26,58.42 45.72,58.42 41.91,62.23 21.59,62.23 13.97,69.85 JP1.3
TXO  (via drill 0.6)
  Top 0.305: v33.02,69.85 31.75,71.12 v19.05,71.12
  Top 0.406: U1.31 52.61,55.98 v50.16,58.42
  Bottom 0.305: 41.27,67.31 35.56,67.31 v33.02,69.85 | v19.05,71.12 17.78,72.39 15.24,72.39
  Bottom 0.406: v50.16,58.42 41.27,67.31 | 15.24,72.39 JP1.2
V_SENS_+
  Top 2.54: 21.59,43.18 R4.1 24.13,40.77 | 24.13,40.77 24.13,35.56 36.83,22.86 F1.P$1 | R8.2 25.4,40.77 24.13,40.77
V_SENS_-  (via drill 0.6)
  Top 0.254: R11.2 97.92,29.34 v96.52,27.94
  Top 2.54: F2.P$1 v86.36,15.24 | v92.71,38.1 R5.1
  Bottom 0.254: v96.52,27.94 86.36,27.94
  Bottom 2.54: v86.36,15.24 86.36,27.94 86.36,36.83 87.63,38.1 v92.71,38.1
V_SENSE_+  (via drill 0.6)
  Top 0.305: 52.07,52.07 53.34,51.44
  Top 0.406: 52.07,52.07 v49.53,54.29 | v38.1,48.26 C12.2 | 53.34,51.44 56.52,51.44 57.41,52.33 U1.24 | v39.69,51.12 41.91,53.34 v41.91,54.61
  Top 1.27: R9.2 R8.1 33.28,45.85 33.27,45.86 33.27,48.62 33.71,48.84 37.36,48.84 v38.1,48.26
  Bottom 0.406: v38.1,48.26 39.37,50.8 v39.69,51.12 | v41.91,54.61 49.21,54.61 v49.53,54.29
V_SENSE_-  (via drill 0.6)
  Top 0.254: R11.1 R13.2 C18.2
  Top 0.305: U1.26 56.61,54.7 56.83,54.93 57.72,54.93 59.94,57.15
  Top 0.406: 59.94,57.15 60.96,57.15 62.23,58.42 81.28,58.42 81.28,57.15 v82.55,55.88 | v92.71,33.02 90.3,30.61 R13.2
  Bottom 0.406: v82.55,55.88 86.36,55.88 96.52,45.72 96.52,34.29 95.25,33.02 v92.71,33.02
VCC  (via drill 0.6, 0.6 pad 0.25)
  Top 0: U1.18 62.77,47.53 62.87,47.62 64.14,46.35
  Top 0.254: C16.2 63.31,47.31 60.01,47.31 59.78,47.53 U1.18 | 64.14,46.35 65.41,46.35 | 3.3V_LINEAR_REG.P$4 76.2,45.72
  Top 0.406: 50.67,15.11 R16.2 48.13,11.43 v35.56,11.43 | v29.21,11.43 R14.2 | U1.4 47.39,49.93 45.79,48.33 | U1.6 45.79,48.33 | 45.79,48.33 45.72,48.26
  Top 0.813: 76.2,45.72 76.2,43.18 73.66,43.18 71.12,40.64 71.12,33.02 v76.2,27.94 | v66.04,16.51 66.04,15.37 R3.2 62.1,16.51 50.8,16.51 50.67,16.38 50.67,15.11 | R16.2 49.53,13.97 44.45,19.05 C9.2 42.04,43.05 v41.91,43.18 41.91,46.99 42.55,47.62 45.09,47.62 45.72,48.26
  Top 1.27: 77.6,53.47 3.3V_LINEAR_REG.P$4 3.3V_LINEAR_REG.P$2
  Top 1.676: 65.41,46.35 68.58,49.53 69.85,49.53 71.12,50.8 74.93,50.8 3.3V_LINEAR_REG.P$4
  Top 1.778: C14.1 77.6,53.47
  Bottom 0.406: v35.56,11.43 v29.21,11.43 | JP1.4 36.83,43.18 v41.91,43.18
  Bottom 0.813: v76.2,27.94 76.2,19.05 74.93,17.78 67.31,17.78 v66.04,16.51

### Text on the board
tPlace: Designed By | Kyle Rakos | Power | Toggle 1 | Toggle 1 | Toggle 2